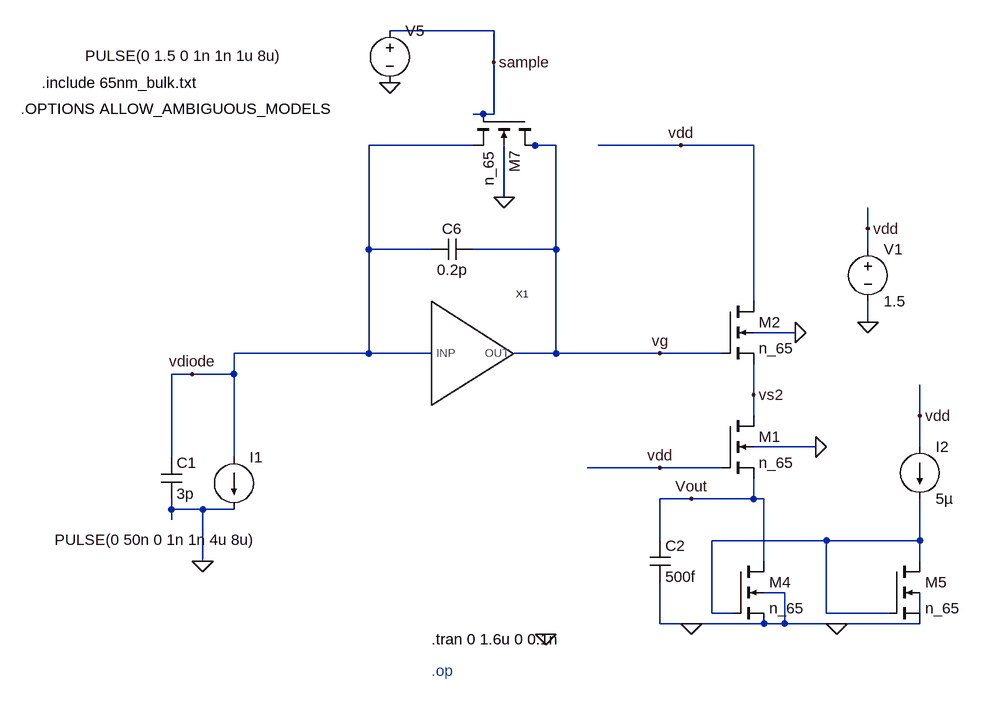
[diagram p0: schematic APS_CTIA.asc]
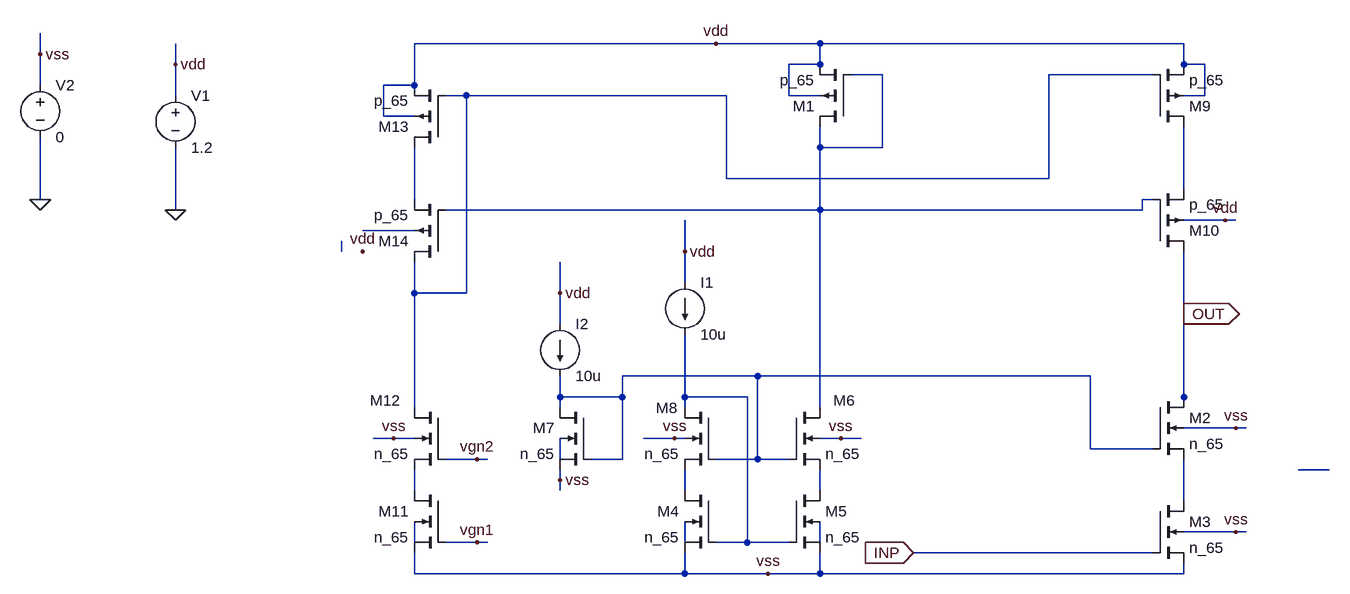
[diagram p1: sub-circuit ota_se.asc]
APS_CTIA.asc, the LTspice schematic file:
Version 4.1
SHEET 1 1428 680
WIRE 416 -432 256 -432
WIRE 416 -384 416 -432
WIRE 400 -304 384 -304
WIRE 416 -304 416 -384
WIRE 416 -304 400 -304
WIRE 384 -256 224 -256
WIRE 480 -256 464 -256
WIRE 512 -256 480 -256
WIRE 704 -256 576 -256
WIRE 816 -256 704 -256
WIRE 432 -176 432 -256
WIRE 448 -176 432 -176
WIRE 992 -128 992 -160
WIRE 224 -96 224 -256
WIRE 320 -96 224 -96
WIRE 512 -96 512 -256
WIRE 512 -96 384 -96
WIRE 992 -96 992 -128
WIRE 816 -16 816 -256
WIRE 992 16 992 -16
WIRE 880 32 816 32
WIRE 224 64 224 -96
WIRE 224 64 16 64
WIRE 320 64 224 64
WIRE 512 64 512 -96
WIRE 512 64 448 64
WIRE 672 64 512 64
WIRE 768 64 672 64
WIRE -48 96 -80 96
WIRE 16 96 16 64
WIRE 16 96 -48 96
WIRE 816 128 816 80
WIRE 816 160 816 128
WIRE 1072 160 1072 112
WIRE 912 208 816 208
WIRE 1072 208 1072 160
WIRE -80 224 -80 96
WIRE 16 224 16 96
WIRE 672 240 560 240
WIRE 768 240 672 240
WIRE 720 288 672 288
WIRE 816 288 816 256
WIRE 816 288 720 288
WIRE 832 288 816 288
WIRE -80 304 -80 288
WIRE -32 304 -80 304
WIRE 16 304 -32 304
WIRE -80 320 -80 304
WIRE 672 352 672 288
WIRE 928 352 752 352
WIRE 1072 352 1072 288
WIRE 1072 352 928 352
WIRE -32 384 -32 304
WIRE 832 384 832 288
WIRE 1072 384 1072 352
WIRE 864 432 832 432
WIRE 752 464 752 352
WIRE 784 464 752 464
WIRE 928 464 928 352
WIRE 1024 464 928 464
WIRE 1072 464 1072 432
WIRE 672 480 672 416
WIRE 720 480 672 480
WIRE 832 480 720 480
WIRE 864 480 864 432
WIRE 864 480 832 480
WIRE 944 480 864 480
WIRE 1072 480 944 480
FLAG -32 384 0
FLAG 992 16 0
FLAG 992 -128 vdd
FLAG 944 480 0
FLAG 720 480 0
FLAG 912 208 0
FLAG 880 32 0
FLAG 1072 160 vdd
FLAG 704 -256 vdd
FLAG 720 288 Vout
FLAG 672 64 vg
FLAG 672 240 vdd
FLAG 816 128 vs2
FLAG -48 96 vdiode
FLAG 496 496 0
FLAG 256 -352 0
FLAG 432 -176 0
FLAG 416 -384 sample
SYMBOL nmos4 768 160 R0
SYMATTR InstName M1
SYMATTR Value n_65
SYMATTR Value2 l=65n w=1u
SYMBOL nmos4 768 -16 R0
SYMATTR InstName M2
SYMATTR Value n_65
SYMATTR Value2 l=65n w=8u
SYMBOL current 16 224 R0
WINDOW 123 0 0 Left 0
WINDOW 39 0 0 Left 0
WINDOW 3 -276 127 Left 2
SYMATTR Value PULSE(0 50n 0 1n 1n 4u 8u)
SYMATTR InstName I1
SYMBOL cap -96 224 R0
SYMATTR InstName C1
SYMATTR Value 3p
SYMBOL voltage 992 -112 R0
WINDOW 123 0 0 Left 0
WINDOW 39 0 0 Left 0
SYMATTR InstName V1
SYMATTR Value 1.5
SYMBOL nmos4 784 384 R0
SYMATTR InstName M4
SYMATTR Value n_65
SYMATTR Value2 l=0.5u w=4u
SYMBOL nmos4 1024 384 R0
SYMATTR InstName M5
SYMATTR Value n_65
SYMATTR Value2 l=0.5u w=2u
SYMBOL current 1072 208 R0
WINDOW 123 0 0 Left 0
WINDOW 39 0 0 Left 0
SYMATTR InstName I2
SYMATTR Value 5µ
SYMBOL cap 656 352 R0
SYMATTR InstName C2
SYMATTR Value 500f
SYMBOL OTA_SE 384 64 R0
SYMATTR InstName X1
SYMBOL cap 320 -80 R270
WINDOW 0 32 32 VTop 2
WINDOW 3 0 32 VBottom 2
SYMATTR InstName C6
SYMATTR Value 0.2p
SYMBOL voltage 256 -448 R0
WINDOW 3 -469 54 Left 2
WINDOW 123 0 0 Left 0
WINDOW 39 0 0 Left 0
SYMATTR Value PULSE(0 1.5 0 1n 1n 1u 8u)
SYMATTR InstName V5
SYMBOL nmos4 480 -304 R90
SYMATTR InstName M7
SYMATTR Value n_65
SYMATTR Value2 l=65n w=2u
TEXT 320 504 Left 2 !.tran 0 1.6u 0 0.1n
TEXT 320 552 Left 2 ;.op
TEXT -280 -352 Left 2 !.include 65nm_bulk.txt
TEXT -312 -312 Left 2 !.OPTIONS ALLOW_AMBIGUOUS_MODELS

ota_se.asc, the sub-circuit schematic file:
Version 4.1
SHEET 1 1220 964
WIRE 272 -240 -192 -240
WIRE 432 -240 272 -240
WIRE 992 -240 432 -240
WIRE -768 -224 -768 -256
WIRE -560 -208 -560 -240
WIRE 432 -208 432 -240
WIRE 432 -208 384 -208
WIRE 992 -208 992 -240
WIRE 1024 -208 992 -208
WIRE 528 -192 480 -192
WIRE 944 -192 784 -192
WIRE -768 -176 -768 -224
WIRE -192 -176 -192 -240
WIRE -192 -176 -240 -176
WIRE -560 -160 -560 -208
WIRE -192 -160 -192 -176
WIRE -112 -160 -144 -160
WIRE 288 -160 -112 -160
WIRE 384 -160 384 -208
WIRE 432 -160 384 -160
WIRE 1024 -160 1024 -208
WIRE 1024 -160 992 -160
WIRE -240 -128 -240 -176
WIRE -192 -128 -240 -128
WIRE 432 -80 432 -112
WIRE 528 -80 528 -192
WIRE 528 -80 432 -80
WIRE 288 -32 288 -160
WIRE 784 -32 784 -192
WIRE 784 -32 288 -32
WIRE 992 -16 992 -112
WIRE -768 0 -768 -96
WIRE -192 0 -192 -80
WIRE 944 0 928 0
WIRE -560 16 -560 -80
WIRE 432 16 432 -80
WIRE 432 16 -144 16
WIRE 928 16 928 0
WIRE 928 16 432 16
WIRE 1056 32 992 32
WIRE 1072 32 1056 32
WIRE -192 48 -272 48
WIRE -304 80 -304 64
WIRE 224 80 224 32
WIRE 224 128 224 80
WIRE -192 144 -192 96
WIRE -112 144 -112 -160
WIRE -112 144 -192 144
WIRE 32 144 32 96
WIRE 992 176 992 80
WIRE 32 192 32 144
WIRE 336 272 128 272
WIRE 848 272 336 272
WIRE 32 304 32 272
WIRE 128 304 128 272
WIRE 128 304 32 304
WIRE 224 304 224 208
WIRE 320 304 224 304
WIRE 992 304 992 176
WIRE -192 320 -192 144
WIRE 32 320 32 304
WIRE 224 320 224 304
WIRE 432 320 432 16
WIRE 992 320 992 304
WIRE 1072 352 992 352
WIRE 1088 352 1072 352
WIRE -224 368 -256 368
WIRE -192 368 -224 368
WIRE 208 368 160 368
WIRE 224 368 208 368
WIRE 464 368 432 368
WIRE 496 368 464 368
WIRE 848 384 848 272
WIRE 944 384 848 384
WIRE -96 400 -144 400
WIRE -80 400 -96 400
WIRE 32 400 32 368
WIRE 128 400 128 304
WIRE 128 400 80 400
WIRE 336 400 336 272
WIRE 336 400 272 400
WIRE 384 400 336 400
WIRE 1216 416 1168 416
WIRE 32 432 32 416
WIRE -192 448 -192 416
WIRE 32 448 32 432
WIRE 224 448 224 416
WIRE 432 448 432 416
WIRE 992 464 992 400
WIRE 1072 512 992 512
WIRE 1088 512 1072 512
WIRE -192 528 -192 496
WIRE -96 528 -144 528
WIRE -80 528 -96 528
WIRE 224 528 224 496
WIRE 320 528 320 304
WIRE 320 528 272 528
WIRE 384 528 320 528
WIRE 432 528 432 496
WIRE 944 544 576 544
WIRE -192 576 -192 544
WIRE 224 576 224 544
WIRE 224 576 -192 576
WIRE 352 576 224 576
WIRE 432 576 432 544
WIRE 432 576 352 576
WIRE 992 576 992 560
WIRE 992 576 432 576
FLAG 224 80 vdd
FLAG 1072 352 vss
FLAG 1072 512 vss
FLAG 464 368 vss
FLAG 352 576 vss
FLAG 32 144 vdd
FLAG 32 432 vss
FLAG 208 368 vss
FLAG 1056 32 vdd
FLAG -224 368 vss
FLAG -96 528 vgn1
FLAG -96 400 vgn2
FLAG -272 80 vdd
FLAG 272 -240 vdd
FLAG -560 16 0
FLAG -560 -208 vdd
FLAG -768 0 0
FLAG -768 -224 vss
FLAG 576 544 INP
IOPIN 576 544 In
FLAG 992 176 OUT
IOPIN 992 176 Out
SYMBOL pmos4 480 -112 R180
SYMATTR InstName M1
SYMATTR Value p_65
SYMATTR Value2 l=200n w=2.5u
SYMBOL nmos4 944 304 R0
SYMATTR InstName M2
SYMATTR Value n_65
SYMATTR Value2 l=300n w=10u
SYMBOL nmos4 944 464 R0
SYMATTR InstName M3
SYMATTR Value n_65
SYMATTR Value2 l=300n w=10u
SYMBOL nmos4 272 448 M0
SYMATTR InstName M4
SYMATTR Value n_65
SYMATTR Value2 l=300n w=10u
SYMBOL current 224 128 R0
WINDOW 123 0 0 Left 0
WINDOW 39 0 0 Left 0
SYMATTR InstName I1
SYMATTR Value 10u
SYMBOL nmos4 384 448 R0
SYMATTR InstName M5
SYMATTR Value n_65
SYMATTR Value2 l=300n w=10u
SYMBOL nmos4 384 320 R0
WINDOW 0 69 -11 Left 2
SYMATTR InstName M6
SYMATTR Value n_65
SYMATTR Value2 l=300n w=10u
SYMBOL nmos4 80 320 M0
SYMATTR InstName M7
SYMATTR Value n_65
SYMATTR Value2 l=300n w=2.5u
SYMBOL current 32 192 R0
WINDOW 123 0 0 Left 0
WINDOW 39 0 0 Left 0
SYMATTR InstName I2
SYMATTR Value 10u
SYMBOL nmos4 272 320 M0
WINDOW 0 59 1 Left 2
SYMATTR InstName M8
SYMATTR Value n_65
SYMATTR Value2 l=300n w=10u
SYMBOL pmos4 944 -112 M180
SYMATTR InstName M9
SYMATTR Value p_65
SYMATTR Value2 l=200n w=10u
SYMBOL pmos4 944 80 M180
SYMATTR InstName M10
SYMATTR Value p_65
SYMATTR Value2 l=200n w=10u
SYMBOL nmos4 -144 448 M0
SYMATTR InstName M11
SYMATTR Value n_65
SYMATTR Value2 l=300n w=10u
SYMBOL nmos4 -144 320 M0
WINDOW 0 69 -11 Left 2
SYMATTR InstName M12
SYMATTR Value n_65
SYMATTR Value2 l=300n w=10u
SYMBOL pmos4 -144 -80 R180
SYMATTR InstName M13
SYMATTR Value p_65
SYMATTR Value2 l=200n w=10u
SYMBOL pmos4 -144 96 R180
SYMATTR InstName M14
SYMATTR Value p_65
SYMATTR Value2 l=200n w=10u
SYMBOL voltage -560 -176 R0
WINDOW 123 0 0 Left 0
WINDOW 39 0 0 Left 0
SYMATTR InstName V1
SYMATTR Value 1.2
SYMBOL voltage -768 -192 R0
WINDOW 123 0 0 Left 0
WINDOW 39 0 0 Left 0
SYMATTR InstName V2
SYMATTR Value 0

The netlist it stands for:
* APS_CTIA.asc
M1 vs2 vdd Vout 0 n_65 l=65n w=1u
M2 vdd vg vs2 0 n_65 l=65n w=8u
I1 vdiode 0 PULSE(0 50n 0 1n 1n 4u 8u)
C1 vdiode 0 3p
V1 vdd 0 1.5
M4 Vout N001 0 0 n_65 l=0.5u w=4u
M5 N001 N001 0 N002 n_65 l=0.5u w=2u
I2 vdd N001 5µ
C2 Vout 0 500f
X§X1 vdiode vg ota_se
C6 vdiode vg 0.2p
V5 sample 0 PULSE(0 1.5 0 1n 1n 1u 8u)
M7 vg sample vdiode 0 n_65 l=65n w=2u

* block symbol definitions
.subckt ota_se INP OUT
M1 N001 N001 vdd vdd p_65 l=200n w=2.5u
M2 OUT N007 N014 vss n_65 l=300n w=10u
M3 N014 INP vss vss n_65 l=300n w=10u
M4 N012 N008 vss N016 n_65 l=300n w=10u
I1 vdd N008 10u
M5 N013 N008 vss N017 n_65 l=300n w=10u
M6 N001 N007 N013 vss n_65 l=300n w=10u
M7 N007 N007 vss N009 n_65 l=300n w=2.5u
I2 vdd N007 10u
M8 N008 N007 N012 vss n_65 l=300n w=10u
M9 N003 N002 vdd vdd p_65 l=200n w=10u
M10 OUT N001 N003 vdd p_65 l=200n w=10u
M11 N011 vgn1 vss N015 n_65 l=300n w=10u
M12 N002 vgn2 N011 vss n_65 l=300n w=10u
M13 N004 N002 vdd vdd p_65 l=200n w=10u
M14 N002 N001 N004 N005 p_65 l=200n w=10u
V1 vdd 0 1.2
V2 vss 0 0
.ends ota_se

.model NMOS NMOS
.model PMOS PMOS
.lib standard.mos
.tran 0 1.6u 0 0.1n
* .op
.include 65nm_bulk.txt
.OPTIONS ALLOW_AMBIGUOUS_MODELS
.backanno
.end